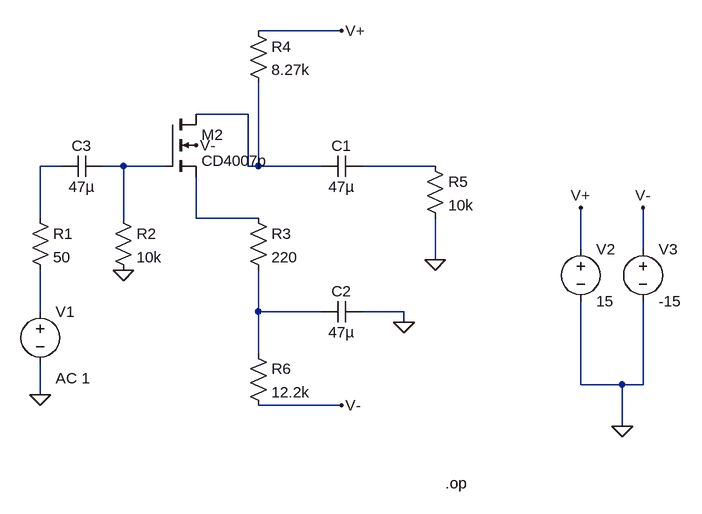
[diagram p0: schematic Draft17.asc]
Draft17.asc, the LTspice schematic file:
Version 4
SHEET 1 1072 760
WIRE 544 48 416 48
WIRE 400 176 320 176
WIRE 112 256 80 256
WIRE 208 256 176 256
WIRE 272 256 208 256
WIRE 400 256 400 176
WIRE 416 256 416 128
WIRE 416 256 400 256
WIRE 512 256 416 256
WIRE 688 256 576 256
WIRE 80 336 80 256
WIRE 208 336 208 256
WIRE 320 336 320 272
WIRE 416 336 320 336
WIRE 912 384 912 320
WIRE 1008 384 1008 320
WIRE 688 400 688 336
WIRE 80 480 80 416
WIRE 416 480 416 416
WIRE 512 480 416 480
WIRE 640 480 576 480
WIRE 640 496 640 480
WIRE 416 544 416 480
WIRE 912 592 912 464
WIRE 976 592 912 592
WIRE 1008 592 1008 464
WIRE 1008 592 976 592
WIRE 80 608 80 560
WIRE 544 624 416 624
WIRE 976 656 976 592
FLAG 688 400 0
FLAG 640 496 0
FLAG 80 608 0
FLAG 208 416 0
FLAG 976 656 0
FLAG 912 320 V+
FLAG 1008 320 V-
FLAG 544 624 V-
FLAG 544 48 V+
FLAG 320 224 V-
SYMBOL res 64 320 R0
SYMATTR InstName R1
SYMATTR Value 50
SYMBOL res 192 320 R0
SYMATTR InstName R2
SYMATTR Value 10k
SYMBOL res 400 320 R0
SYMATTR InstName R3
SYMATTR Value 220
SYMBOL res 400 32 R0
SYMATTR InstName R4
SYMATTR Value 8.27k
SYMBOL res 672 240 R0
SYMATTR InstName R5
SYMATTR Value 10k
SYMBOL res 400 528 R0
SYMATTR InstName R6
SYMATTR Value 12.2k
SYMBOL cap 576 240 R90
WINDOW 0 0 32 VBottom 2
WINDOW 3 32 32 VTop 2
SYMATTR InstName C1
SYMATTR Value 47µ
SYMBOL cap 576 464 R90
WINDOW 0 0 32 VBottom 2
WINDOW 3 32 32 VTop 2
SYMATTR InstName C2
SYMATTR Value 47µ
SYMBOL cap 176 240 R90
WINDOW 0 0 32 VBottom 2
WINDOW 3 32 32 VTop 2
SYMATTR InstName C3
SYMATTR Value 47µ
SYMBOL voltage 80 464 R0
WINDOW 123 24 118 Left 2
SYMATTR Value2 AC 1
SYMATTR InstName V1
SYMATTR Value ""
SYMBOL voltage 912 368 R0
SYMATTR InstName V2
SYMATTR Value 15
SYMBOL voltage 1008 368 R0
SYMATTR InstName V3
SYMATTR Value -15
SYMBOL nmos4 272 176 R0
SYMATTR InstName M2
SYMATTR Value CD4007p
TEXT 704 744 Left 2 !.op

The netlist it stands for:
* Draft17.asc
R1 N002 N006 50
R2 N003 0 10k
R3 N005 N007 220
R4 V+ N001 8.27k
R5 N004 0 10k
R6 N007 V- 12.2k
C1 N004 N001 47µ
C2 0 N007 47µ
C3 N003 N002 47µ
V1 N006 0 AC 1
V2 V+ 0 15
V3 V- 0 -15
M2 N001 N003 N005 V- CD4007p
.model NMOS NMOS
.model PMOS PMOS
.lib standard.mos
.op
.backanno
.end